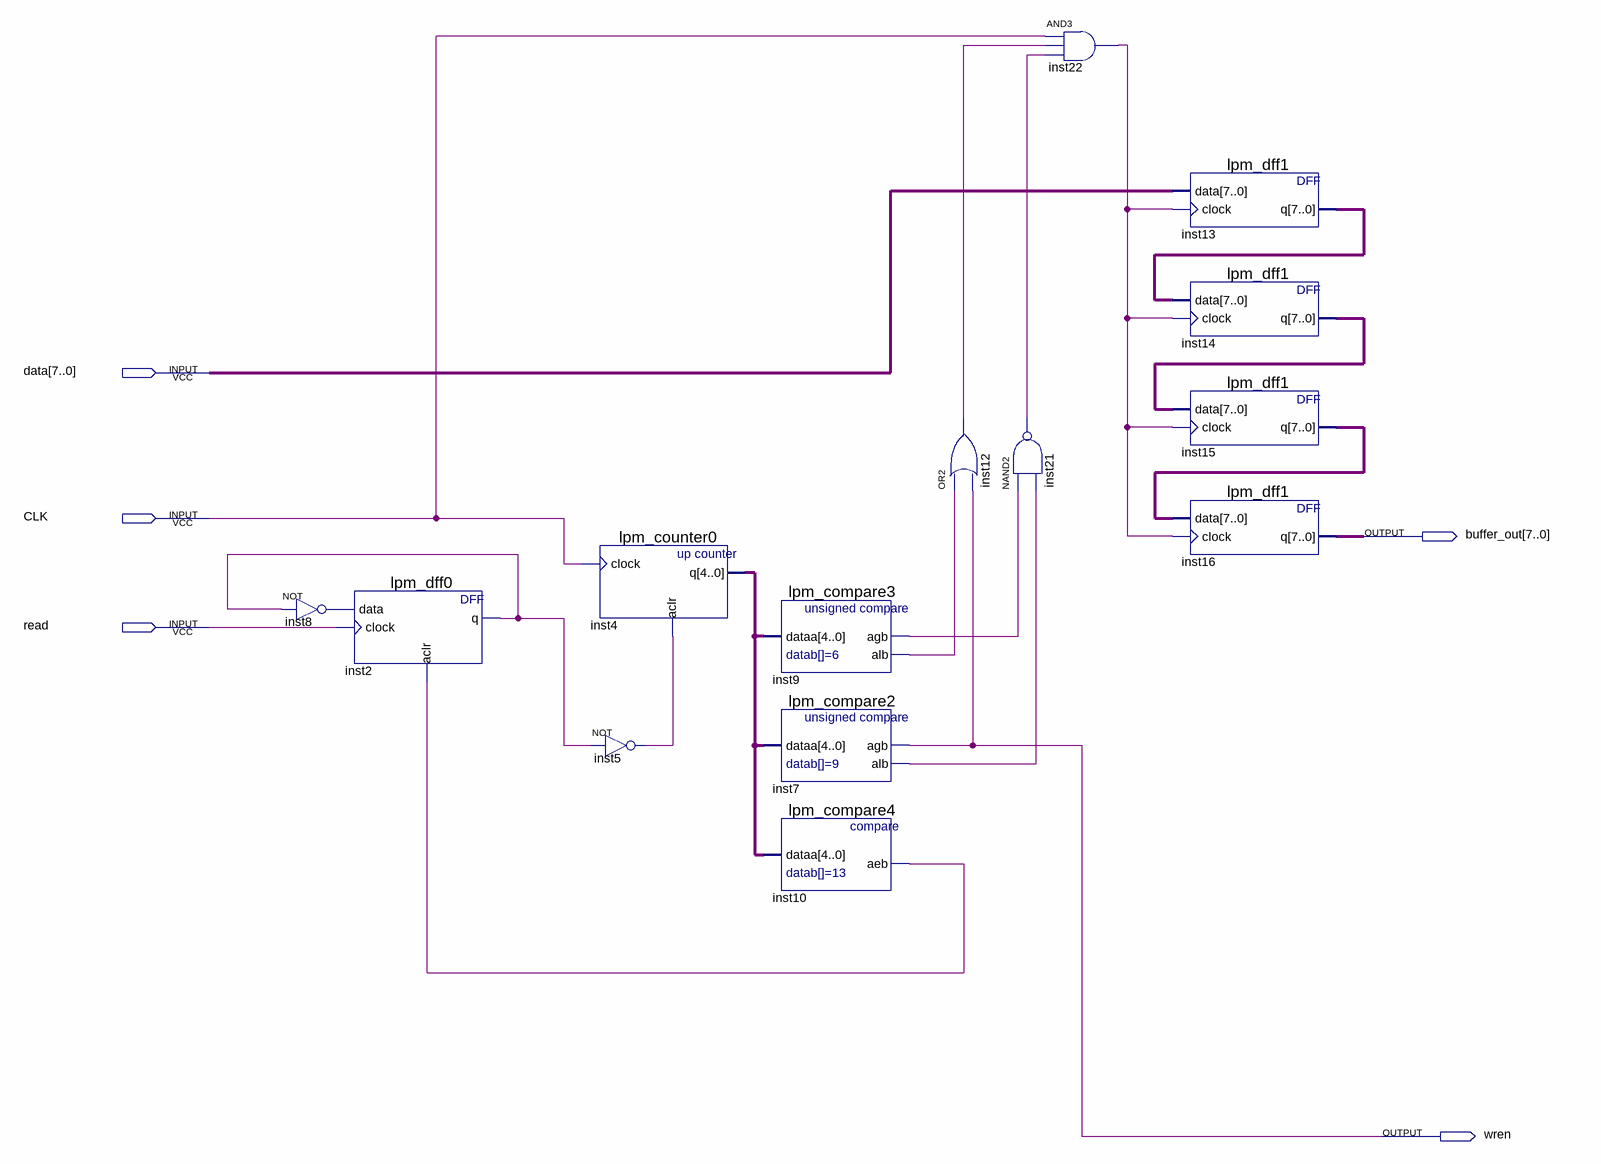
[diagram p0: schematic sheet]
// Quartus schematic buffer_block.bdf as structural Verilog: 14 symbols, 5 pins
module buffer_block (
  input  [7:0] data,
  input  CLK,
  input  read,
  output [7:0] buffer_out,
  output wren
);

  wire inst2_q, inst5_out, inst7_alb, inst8_out, inst9_agb, inst9_alb, inst10_aeb, inst12_out, inst21_out,
       inst22_out;
  wire [4:0] inst4_q;
  wire [7:0] inst13_q, inst14_q, inst15_q;

  lpm_dff0 inst2 (.data(inst8_out), .clock(read), .aclr(inst10_aeb), .q(inst2_q));
  not inst8 (inst8_out, inst2_q);
  lpm_counter0 inst4 (.clock(CLK), .aclr(inst5_out), .q(inst4_q));
  not inst5 (inst5_out, inst2_q);
  lpm_compare3 inst9 (.dataa(inst4_q), .agb(inst9_agb), .alb(inst9_alb));
  lpm_compare2 inst7 (.dataa(inst4_q), .agb(wren), .alb(inst7_alb));
  lpm_compare4 inst10 (.dataa(inst4_q), .aeb(inst10_aeb));
  or inst12 (inst12_out, inst9_alb, wren);
  nand inst21 (inst21_out, inst9_agb, inst7_alb);
  and inst22 (inst22_out, CLK, inst12_out, inst21_out);
  lpm_dff1 inst13 (.data(data), .clock(inst22_out), .q(inst13_q));
  lpm_dff1 inst14 (.data(inst13_q), .clock(inst22_out), .q(inst14_q));
  lpm_dff1 inst15 (.data(inst14_q), .clock(inst22_out), .q(inst15_q));
  lpm_dff1 inst16 (.data(inst15_q), .clock(inst22_out), .q(buffer_out));
endmodule
